# EAGLE design signalConditioner (EAGLE 6.5.0)
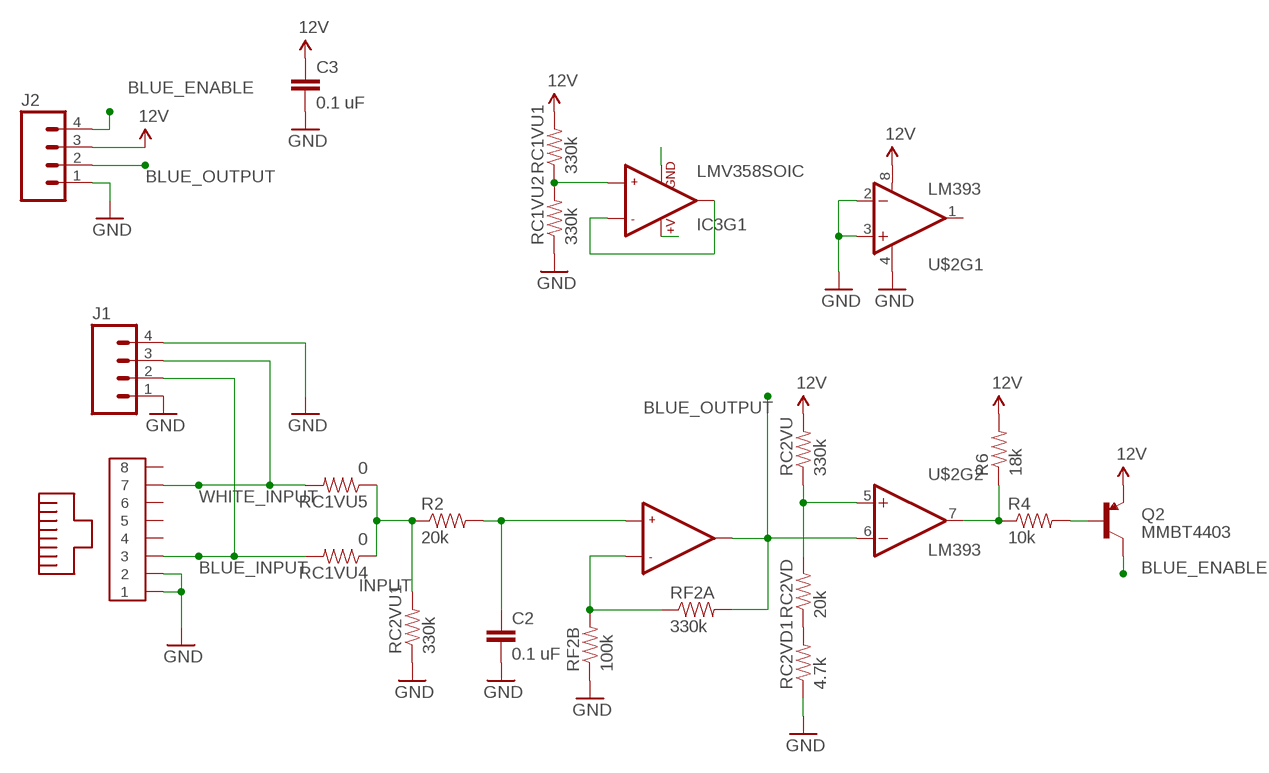
[diagram p0: schematic, sheet 1]

## Parts
C2  0.1 uF  CAP1206  [1206]
C3  0.1 uF  CAP1206  [1206]
IC3  LMV358SOIC  [SO08]
J1  M04LONGPADS  [1X04_LONGPADS]
J2  M04LONGPADS  [1X04_LONGPADS]
Q2  MMBT4403  TRANSISTOR_PNPMMBT4403  [SOT23-3]
R2  20k  RESISTOR1206  [1206]
R4  10k  RESISTOR1206  [1206]
R6  18k  RESISTOR1206  [1206]
RC1VU1  330k  RESISTOR1206  [1206]
RC1VU2  330k  RESISTOR1206  [1206]
RC1VU4  0  RESISTOR1206  [1206]
RC1VU5  0  RESISTOR1206  [1206]
RC2VD  20k  RESISTOR1206  [1206]
RC2VD1  4.7k  RESISTOR1206  [1206]
RC2VU  330k  RESISTOR1206  [1206]
RC2VU1  330k  RESISTOR1206  [1206]
RF2A  330k  RESISTOR1206  [1206]
RF2B  100k  RESISTOR1206  [1206]
U$1  MOLEX-RJ45-SMT  [MOLEX-RJ45-SMT]
U$2  LM393  [SO08]

## Nets
12V: C3.1 IC3.8(+V) J2.3 Q2.2(E) R6.2 RC1VU1.2 RC2VU.2 U$2.8(V+)
BLUE_ENABLE: J2.4 Q2.3(C)
BLUE_INPUT: J1.2 RC1VU4.2 U$1.3
BLUE_OUTPUT: IC3.7(OUT2) J2.2 RF2A.2 U$2.6(-IN)
GND: C2.2 C3.2 IC3.4(GND) J1.1 J1.4 J2.1 RC1VU2.1 RC2VD1.1 RC2VU1.1 RF2B.1 U$1.1 U$1.2 U$2.2(-IN) U$2.3(+IN) U$2.4(V-)
INPUT: R2.1 RC1VU4.1 RC1VU5.1 RC2VU1.2
N$1: Q2.1(B) R4.2
N$2: RC2VD1.2 RC2VD.1
N$4: IC3.1(OUT1) IC3.2(-IN1)
N$5: RC2VD.2 RC2VU.1 U$2.5(+IN)
N$6: IC3.6(-IN2) RF2A.1 RF2B.2
N$7: IC3.3(+IN1) RC1VU1.1 RC1VU2.2
N$8: C2.1 IC3.5(+IN2) R2.2
N$11: R4.1 R6.1 U$2.7(OUT)
WHITE_INPUT: J1.3 RC1VU5.2 U$1.7
Unconnected: U$1.4 U$1.5 U$1.6 U$1.8 U$2.1(OUT)

## Library data of the parts
C2 C3 = SparkFun-Capacitors:CAP: Capacitor Standard 0603 ceramic capacitor, and 0.1" leaded capacitor.
IC3 = SparkFun-AnalogIC:LMV358: Jellybean rail-to-rail output op-amp; PROD_ID: IC-09657
J1 J2 = SparkFun-Connectors:M04: Header 4 Standard 4-pin 0.1" header. Use with straight break away headers (SKU : PRT-00116), right angle break away headers (PRT-00553), swiss pins (PRT-00743), machine pins (PRT-00117), and female headers (PRT-00115). Molex polarized connector foot print use with SKU : PRT-08231 with associated crimp pins and housings. 1MM SMD Version SKU: PRT-10208; PROD_ID: CONN-09696
Q2 = SparkFun-DiscreteSemi:TRANSISTOR_PNP: Generic PNP BJT Double check pinouts against datasheets- not all devices are the same! MMBT3906 - 40V 200mA SOT-23 (TRANS-08052) MMBT4403 - 40V 600mA SOT-23 (TRANS-09245); PROD_ID: TRANS-09245
R2 R4 R6 RC1VU1 RC1VU2 RC1VU4 RC1VU5 RC2VD RC2VD1 RC2VU RC2VU1 RF2A RF2B = SparkFun-Resistors:RESISTOR: Resistor Basic schematic elements and footprints for 0603, 1206, and PTH resistors.
U$1 = SMD-RJ45:MOLEX-RJ45-SMT
U$2 = SparkFun-AnalogIC:LM393: Low-voltage comparator

## Board
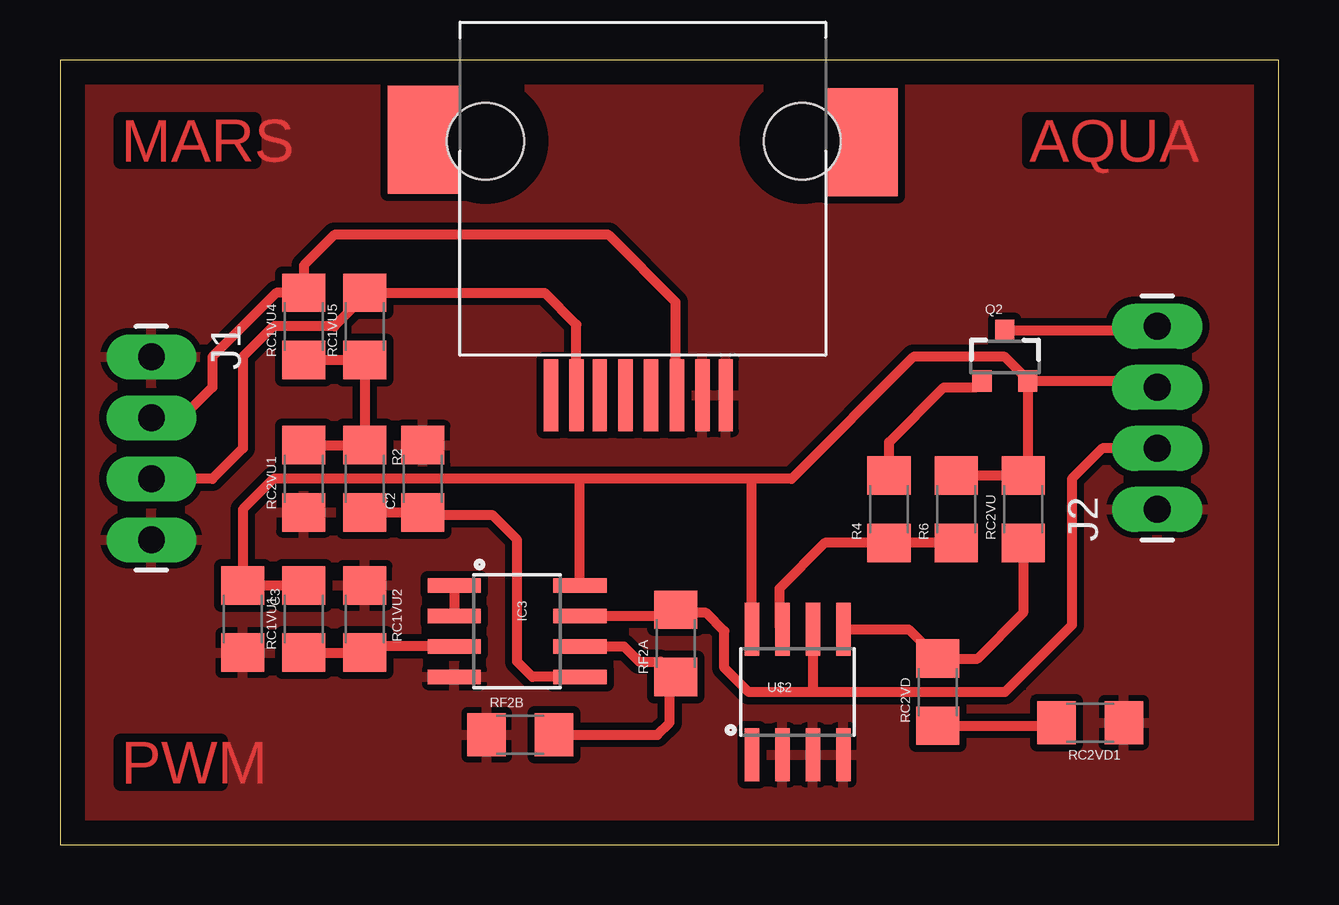
[diagram p1: board, top side]

Size 50.78 x 32.69 mm. Coordinates in mm from the lower left corner, seen from the top.
Outline: 0,0 50.78,0 50.78,32.69 0,32.69 0,0
Copper layers (1*16): Top 0.035mm / dielectric 1.5mm / Bottom 0.035mm
Design rules "default": minimum track width 10mil, minimum drill 24mil, track to track 8mil, track to pad 8mil, pad to pad 8mil, via to via 8mil, smd to smd 8mil, copper to edge 40mil, drill to drill 8mil, minimum pad ring 10mil, minimum via ring 8mil, stop-mask expansion 4mil, vias tented up to drill 0mil, thermal gap 10mil

### Footprints (pad centres in the part's own frame; a part is rotated, then mirrored left to right if it is on the bottom)
1206 = smd 1.6 x 1.8: 1 -1.4,0; 2 1.4,0
SO08 = smd 0.61 x 2.21: 1 -1.905,-2.616; 2 -0.635,-2.616; 3 0.635,-2.616; 4 1.905,-2.616; 5 1.905,2.616; 6 0.635,2.616; 7 -0.635,2.616; 8 -1.905,2.616
1X04_LONGPADS = drill 1.118 pad 1.88 long: 1 0,0; 2 2.54,0; 3 5.08,0; 4 7.62,0
SOT23-3 = smd 0.8 x 0.9: 1 -0.95,-1; 2 0.95,-1; 3 0,1.1
MOLEX-RJ45-SMT = smd 3 x 0.6: 1 10.48,3.61; 2 10.48,2.64; 3 10.48,1.57; 4 10.48,0.5; 5 10.48,-0.57; 6 10.48,-1.64; 7 10.48,-2.61; 8 10.48,-3.68 | smd 4.5 x 3: P$1 -0.16,-8.97; P$2 -0.06,9.28 | hole 3.2: -0.1,6.8; -0.1,-6.4

### Placement (x,y rotation side)
C2  15.11,15.24 90 top
C3  7.62,9.4 270 top
IC3  19.05,8.89 270 top
J1  3.81,20.32 270 top
J2  45.72,13.97 90 top
Q2  39.37,20.32 0 top
R2  12.7,15.24 270 top
R4  34.54,13.97 90 top
R6  37.34,13.97 90 top
RC1VU1  10.16,9.4 90 top
RC1VU2  12.7,9.4 270 top
RC1VU4  10.16,21.59 90 top
RC1VU5  12.7,21.59 90 top
RC2VD  36.58,6.35 90 top
RC2VD1  42.93,5.08 180 top
RC2VU  40.13,13.97 90 top
RC2VU1  10.16,15.24 90 top
RF2A  25.65,8.38 90 top
RF2B  19.18,4.57 0 top
U$1  24.13,29.21 270 top
U$2  30.73,6.35 0 top

### Tracks (layer width: path | path; a pad name or v marks a point on that pad's centre or on a via)
12V
  Top 0.406: 28.83,15.24 30.48,15.24 35.56,20.32 39.37,20.32 40.32,19.37 Q2.2 | 28.83,15.24 21.59,15.24 | 21.59,15.24 8.89,15.24 7.62,13.97 C3.1 RC1VU1.2 | Q2.2 40.32,15.56 RC2VU.2 R6.2 | 21.59,15.24 21.67,15.16 IC3.8 | U$2.8 28.83,15.24 | Q2.2 45.45,19.32 J2.3
BLUE_ENABLE
  Top 0.406: Q2.3 45.55,21.42 J2.4
BLUE_INPUT
  Top 0.406: U$1.3 25.65,18.78 25.65,22.61 22.86,25.4 11.43,25.4 10.16,24.13 RC1VU4.2 9.02,22.99 6.35,20.32 6.35,19.05 5.08,17.78 J1.2
BLUE_OUTPUT
  Top 0.406: RF2A.2 25.27,10.29 | IC3.7 25.4,9.53 RF2A.2 | J2.2 43.43,16.51 42.16,15.24 42.16,9.14 39.37,6.35 31.24,6.35 | 31.24,6.35 28.7,6.35 27.69,7.37 27.69,8.89 26.92,9.65 25.78,9.65 RF2A.2 | U$2.6 31.37,6.48 31.24,6.35
GND
  pour Top (isolate 0.305): 0,33.02 50.8,33.02 50.8,0 0,0
INPUT
  Top 0.406: RC1VU4.1 RC1VU5.1 R2.1 RC2VU1.2
N$1
  Top 0.406: R4.2 34.54,16.76 36.83,19.05 38.15,19.05 Q2.1
N$2
  Top 0.406: RC2VD.1 41.53,4.95 RC2VD1.2
N$4
  Top 0.406: IC3.1 IC3.2
N$5
  Top 0.406: 36.45,7.62 RC2VD.2 | RC2VD.2 38.23,7.75 40.13,9.65 RC2VU.1 | U$2.5 35.36,8.97 RC2VD.2
N$6
  Top 0.406: IC3.6 23.5,8.26 24.13,7.62 25.02,7.62 RF2A.1 25.4,6.73 25.4,5.08 24.89,4.57 RF2B.2
N$7
  Top 0.406: RC1VU1.1 RC1VU2.2 12.96,8.26 IC3.3
N$8
  Top 0.406: R2.2 14.48,13.84 | 14.48,13.84 C2.1 15.24,13.71 | IC3.5 19.68,6.99 19.05,7.62 19.05,12.7 18.03,13.72 14.6,13.72 14.48,13.84
N$11
  Top 0.406: U$2.7 29.97,9.09 29.97,10.67 31.87,12.57 R4.1 R6.1
WHITE_INPUT
  Top 0.406: U$1.7 21.52,21.66 20.19,22.99 RC1VU5.2 12.7,22.86 11.43,21.59 8.89,21.59 7.62,20.32 7.62,16.51 6.35,15.24 J1.3
(copper drawn outside any net)
  shapes: Top area x4

### Text on the board
Top: MARS | AQUA | PWM